# Altium schematic sheet lab1_shkabara_usb_rs232.SchDoc: =title_line_1 + title_line_2
size 594 x 420 mm; SheetNumber: n
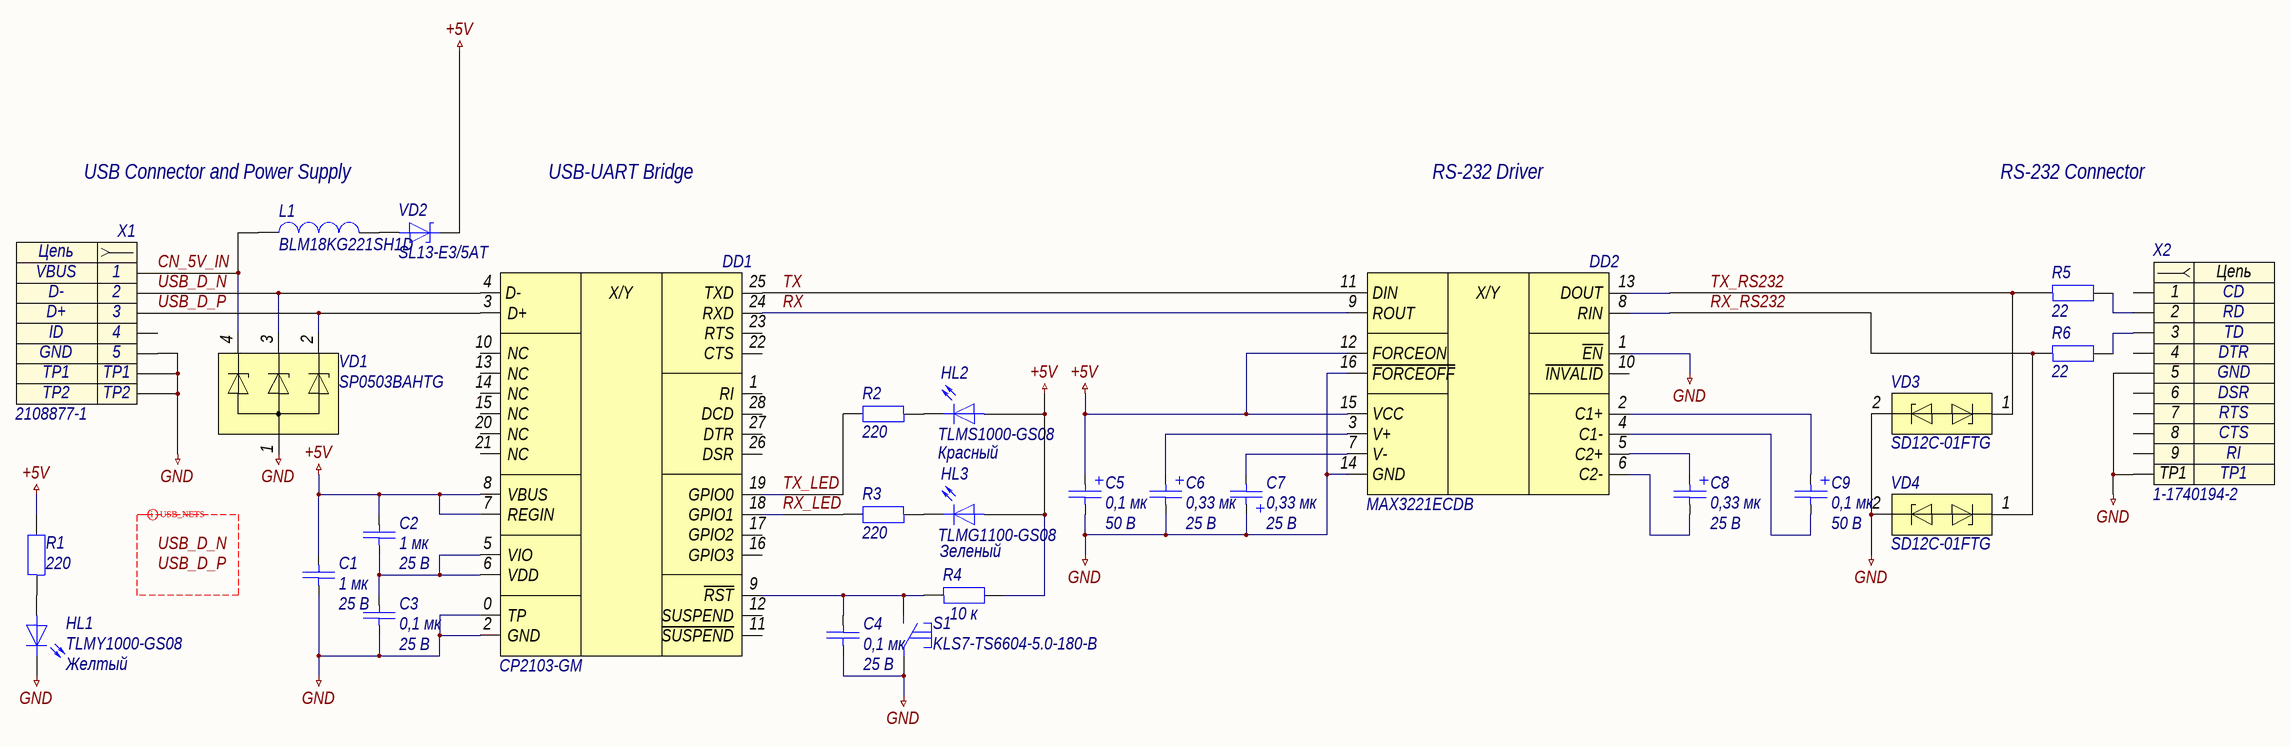
[diagram p0: lab1_shkabara_usb_rs232.SchDoc]

## Parts
C1  1 мк  Напряжение: 25 В  [C0603]
C2  1 мк  Напряжение: 25 В  [C0603]
C3  0,1 мк  Напряжение: 25 В  [C0603]
C4  0,1 мк  Напряжение: 25 В  [C0603]
C5  0,1 мк  Напряжение: 50 В  [C3216-18]
C6  0,33 мк  Напряжение: 25 В  [C3216-18]
C7  0,33 мк  Напряжение: 25 В  [C3216-18]
C8  0,33 мк  Напряжение: 25 В  [C3216-18]
C9  0,1 мк  Напряжение: 50 В  [C3216-18]
DD1  CP2103-GM  [QFN-28-500X500X90]
DD2  MAX3221ECDB  [SSOP-16-620X530X195]
HL1  TLMY1000-GS08  Цвет: Желтый  [HL0603]
HL2  TLMS1000-GS08  Цвет: Красный  [HL0603]
HL3  TLMG1100-GS08  Цвет: Зеленый  [HL0603]
L1  BLM18KG221SH1D  [BLM-2-0603]
R1  220  [R0603]
R2  220  [R0603]
R3  220  [R0603]
R4  10 к  [R0603]
R5  22  [R0603]
R6  22  [R0603]
S1  KLS7-TS6604-5.0-180-B  [KLS7-TS6604-5.0-180-B]
VD1  SP0503BAHTG  [SOT-143-4]
VD2  SL13-E3/5AT  [DO-214AC]
VD3  SD12C-01FTG  [SOD-323]
VD4  SD12C-01FTG  [SOD-323]
X1  2108877-1  [2108877-1]
X2  1-1740194-2  [1-1740194-2]

## Nets
+5V: C1.1 C2.1 C5.1 DD1.7(REGIN) DD1.8(VBUS) DD2.12(FORCEON) DD2.15(VCC) HL2.2 HL3.2 R1.2 R4.2 VD2.1
GND: C1.2 C3.2 C4.1 C5.2 C6.2 C7.1 DD1.0(TP) DD1.2(GND) DD2.1(~{EN}) DD2.14(GND) DD2.16(~{FORCEOFF}) HL1.1 S1.1 VD1.1 VD3.2 VD4.2 X1.5 X1.TP1 X1.TP2 X2.5 X2.TP1
CN_5V_IN: L1.1 VD1.4 X1.1
RX: DD1.24(RXD) DD2.9(ROUT)
RX_LED: DD1.18(GPIO1) R3.2
RX_RS232: DD2.8(RIN) R6.1 VD4.1
TX: DD1.25(TXD) DD2.11(DIN)
TX_LED: DD1.19(GPIO0) R2.2
TX_RS232: DD2.13(DOUT) R5.1 VD3.1
USB_D_N: DD1.4(D-) VD1.3 X1.2
USB_D_P: DD1.3(D+) VD1.2 X1.3
NetC2_2: C2.2 C3.1 DD1.5(VIO) DD1.6(VDD)
NetC4_2: C4.2 DD1.9(~{RST}) R4.1 S1.2
NetC6_1: C6.1 DD2.3(V+)
NetC7_2: C7.2 DD2.7(V-)
NetC8_1: C8.1 DD2.5(C2+)
NetC8_2: C8.2 DD2.6(C2-)
NetC9_1: C9.1 DD2.2(C1+)
NetC9_2: C9.2 DD2.4(C1-)
NetHL1_2: HL1.2 R1.1
NetHL2_1: HL2.1 R2.1
NetHL3_1: HL3.1 R3.1
NetL1_2: L1.2 VD2.2
NetR5_2: R5.2 X2.2
NetR6_2: R6.2 X2.3

Not connected (* = marked no-connect by the designer): DD1 1(RI) 10(NC) 11(~{SUSPEND}) 12(SUSPEND) 13(NC) 14(NC) 15(NC) 16(GPIO3) 17(GPIO2) 20(NC) 21(NC) 22(CTS) 23(RTS) 26(DSR) 27(DTR) 28(DCD); DD2 10(~{INVALID}); X1 4; X2 1 4 6 7 8 9

## Layout directives
differential pair; rule Differential Pairs Routing [Pref Gap = 0.254mm    Min Gap  = 0.15mm    Max Gap  = 0.254mmPref Width = 0.381mm    Min Width  = 0.155mm    Max Width  = 0.381mm]; differential pair class USB_SIGNALS: USB_D_N, USB_D_P

## Notes on the sheet
- USB Connector and Power Supply
- USB-UART Bridge
- RS-232 Driver
- RS-232 Connector
- Labels drawn without touching a wire or pin: USB_D_N, USB_D_P
- Перв. примен.
- Справ. №
- Подп. и дата
- Инв. № дубл.
- Нормоконтроль:
- Взам. инв. №
- Изм.
- Лист
- № докум.
- Подп.
- Дата
- Лит.
- Масса
- Масштаб
- Т.контр.
- Пров.
- Разраб.
- Листов
- Разработал:
- Инв. № подл.
- Н.контр.
- Утв.
- Копировал
- Формат
- А2
- (in symbol 2108877-1_micro_usb-b) Цепь
- (in symbol dd0004) X/Y
- (in symbol dd0019) X/Y
- (in symbol HEADER-9-TP1-SCT) Цепь

## Library data of the parts
C1 C2 = c0090: =Описание; ID: c0090; Фамилия: Ларионов; Описание: Конденсатор керамический чип 0603 1 мкФ 25 В ±10 %; Наименование: CC0603KRX7R8BB105; Производитель: YAGEO Corp.; Отклонение: ±10 %; Рабочие температуры: от –55 °С до +125 °С; Температурный коэффициент емкости: X7R; Корпус: 0603; Номинал: 1 мк; Номинальное напряжение: 25 В; HelpURL: https://www.yageo.com/upload/media/product/productsearch/datasheet/mlcc/UPY-GPHC_X7R_6.3V-to-50V_20.pdf
C3 C4 = c0058: =Описание; ID: c0058; Фамилия: Паньков; Описание: Конденсатор керамический чип 0603 100 нФ 25 В ±10 %; Наименование: CC0603KRX7R8BB104; Производитель: YAGEO Corp.; Отклонение: ±10 %; Рабочие температуры: от –55 °С до +125 °С; Температурный коэффициент емкости: X7R; Корпус: 0603; Номинал: 0,1 мк; Номинальное напряжение: 25 В; HelpURL: https://www.yageo.com/upload/media/product/productsearch/datasheet/mlcc/UPY-GPHC_X7R_6.3V-to-50V_20.pdf
C5 C9 = c0001: =Описание; ID: c0001; Фамилия: Ларионов; Описание: Конденсатор танталовый чип 3216-18 100 нФ 50 В ±10 %; Наименование: 293D104X9050A2TE3; Производитель: Vishay Intertechnology, Inc.; Отклонение: ±10 %; Эквивалентное последовательное сопротивление: 19,0 Ом; Среднеквадратичный размах пульсации тока: 0,06 А; Рабочие температуры: от –55 °С до +125 °С; Корпус: 3216-18; Номинал: 0,1 мк; Номинальное напряжение: 50 В; HelpURL: https://www.vishay.com/capacitors/list/product-40002/
C6-C8 = c0004: =Описание; ID: c0004; Фамилия: Паньков; Описание: Конденсатор танталовый чип 3216-18 330 нФ 25 В ±10 %; Наименование: 293D334X9025A2TE3; Производитель: Vishay Intertechnology, Inc.; Отклонение: ±10 %; Эквивалентное последовательное сопротивление: 13,0 Ом; Среднеквадратичный размах пульсации тока: 0,08 А; Рабочие температуры: от –55 °С до +125 °С; Корпус: 3216-18; Номинал: 0,33 мк; Номинальное напряжение: 25 В; HelpURL: https://www.vishay.com/capacitors/list/product-40002/
DD1 = dd0004: =Описание; ID: dd0004; Фамилия: Кондрашова; Описание: Преобразователь USB-UART; Производитель: Silicon Laboratories; Корпус: QFN-28; Наименование: CP2103-GM; HelpURL: https://www.silabs.com/interface/usb-bridges/classic/device.cp2103
DD2 = dd0019: =Описание; ID: dd0019; Фамилия: Шкабара; Описание: Приемопередатчик RS-232; Производитель: Texas Instruments; Корпус: SSOP-16; Наименование: MAX3221ECDB; HelpURL: https://www.ti.com/product/MAX3221E
HL1 = hl0003: =Описание; ID: hl0003; Фамилия: Ларионов; Описание: Светодиод чип 0603 желтый; Производитель: Vishay Intertechnology, Inc.; Номинальная сила света: 7,5 мкд; Номинальная длина волны: 588 нм; Номинальный прямой ток: 15 мА; Номинальное падение напряжения: 1,8 В; Рассеиваемая мощность: 40 мВт; Рабочие температуры: от –40 °С до +100 °С; Корпус: 0603; Наименование: TLMY1000-GS08; HelpURL: https://www.vishay.com/leds/list/product-83172/
HL2 = hl0001: =Описание; ID: hl0001; Фамилия: Ларионов; Описание: Светодиод чип 0603 красный; Производитель: Vishay Intertechnology, Inc.; Номинальная сила света: 4 мкд; Номинальная длина волны: 628 нм; Номинальный прямой ток: 15 мА; Номинальное падение напряжения: 1,8 В; Рассеиваемая мощность: 40 мВт; Рабочие температуры: от –40 °С до +100 °С; Корпус: 0603; Наименование: TLMS1000-GS08; HelpURL: https://www.vishay.com/leds/list/product-83172/
HL3 = hl0005: =Описание; ID: hl0005; Фамилия: Ларионов; Описание: Светодиод чип 0603 зеленый; Производитель: Vishay Intertechnology, Inc.; Номинальная сила света: 35 мкд; Номинальная длина волны: 570 нм; Номинальный прямой ток: 30 мА; Номинальное падение напряжения: 2,1 В; Рассеиваемая мощность: 90 мВт; Рабочие температуры: от –40 °С до +100 °С; Корпус: 0603; Наименование: TLMG1100-GS08; HelpURL: https://www.vishay.com/leds/list/product-83173/
L1 = l0001: =Описание; ID: l0001; Фамилия: Ларионов; Описание: Ферритовая бусина 220 Ом ±25 %; Производитель: Murata Manufacturing Co., Ltd.; Сопротивление, 100 МГц: 220 Ом; Отклонение, 100 МГц: ±25 %; Сопротивление при постоянном токе: 0,05 Ом; Рабочие температуры: от –55 °С до +125 °С; Корпус: 0603; Наименование: BLM18KG221SH1D; HelpURL: https://www.murata.com/en-global/products/productdetail?partno=BLM18KG221SH1%23
R1-R3 = r0015: =Описание; ID: r0015; Фамилия: Ларионов; Описание: Резистор чип 0603 220 Ом ±1 % 0,1 Вт; Наименование: RC0603FR-07220RL; Производитель: YAGEO Corp.; Отклонение: ±1 %; Номинальное напряжение: 75 В; Номинальный ток: 1 А; Рабочие температуры: от –55 °С до +155 °С; Корпус: 0603; Примечание: Ряд E24; Номинал: 220; HelpURL: https://www.yageo.com/upload/media/product/productsearch/datasheet/rchip/PYu-RC_Group_51_RoHS_L_11.pdf
R4 = r0060: =Описание; ID: r0060; Фамилия: Самарин; Описание: Резистор чип 0603 10 кОм ±1 % 0,1 Вт; Наименование: RC0603FR-0710KL; Производитель: YAGEO Corp.; Отклонение: ±1 %; Номинальное напряжение: 75 В; Номинальный ток: 1 А; Рабочие температуры: от –55 °С до +155 °С; Корпус: 0603; Примечание: Ряд E24; Номинал: 10 к; HelpURL: https://www.yageo.com/upload/media/product/productsearch/datasheet/rchip/PYu-RC_Group_51_RoHS_L_11.pdf
R5 R6 = r0004: =Описание; ID: r0004; Фамилия: Ларионов; Описание: Резистор чип 0603 22 Ом ±1 % 0,1 Вт; Наименование: RC0603FR-0722RL; Производитель: YAGEO Corp.; Отклонение: ±1 %; Номинальное напряжение: 75 В; Номинальный ток: 1 А; Рабочие температуры: от –55 °С до +155 °С; Корпус: 0603; Примечание: Ряд E24; Номинал: 22; HelpURL: https://www.yageo.com/upload/media/product/productsearch/datasheet/rchip/PYu-RC_Group_51_RoHS_L_11.pdf
S1 = s0002: =Описание; ID: s0002; Фамилия: Паньков; Описание: Тактовая кнопка поверхностного монтажа; Производитель: Ningbo KLS Electronic Co., Ltd.; Ток нагрузки: 50 мА @ 12 В; Сопротивление контакта: 50 мОм; Количество контактов: 4; Рабочие температуры: от –20 °С до +70 °С; Промывка: Запрещена; Корпус: 6,00 x 6,00 x 5,00; Наименование: KLS7-TS6604-5.0-180-B; HelpURL: http://www.klsele.com/products/Switches/Tact-Switches-Series/939.html
VD1 = vd0001: =Описание; ID: vd0001; Фамилия: Ларионов; Описание: Диодная сборка для подавления помех, 5 В; Производитель: Littelfuse, Inc.; Наименование: SP0503BAHTG; Корпус: SOT-143-4; HelpURL: https://www.littelfuse.com/products/tvs-diode-arrays/general-purpose-esd-protection/sp050xba-lead-free-green.aspx
VD2 = vd0003: =Описание; ID: vd0003; Фамилия: Ларионов; Описание: Диод Шоттки 30 В 1,5 А; Производитель: Vishay Intertechnology, Inc.; Максимальное прямое напряжение: 0,445 В; Максимальное обратное напряжение: 30 В; Максимальный прямой ток: 1,5 А; Рабочие температуры: от –55 °С до +125 °С; Наименование: SL13-E3/5AT; Корпус: DO-214AC; HelpURL: https://www.vishay.com/product?docid=88740
VD3 VD4 = vd0003: =Описание; ID: vd0003; Фамилия: Ларионов; Описание: Двунаправленная диодная сборка для подавления помех, 12 В; Производитель: Littelfuse, Inc.; Наименование: SD12C-01FTG; Корпус: SOD-323; HelpURL: https://www.littelfuse.com/products/tvs-diode-arrays/general-purpose-esd-protection/sdc/sd12c_01ftg.aspx
X1 = 2108877-1_micro_usb-b: Contact_1: VBUS; Contact_2: D-; Contact_3: D+; Contact_4: ID; Contact_5: GND; Наименование: 2108877-1
X2 = HEADER-9-TP1-SCT: D-Sub 9 pin Board-to-Board; Contact_1: CD; Contact_2: RD; Contact_3: TD; Contact_4: DTR; Contact_5: GND; Contact_6: DSR; Contact_7: RTS; Contact_8: CTS; Contact_9: RI; ID: x0002; Фамилия: Ларионов; Производитель: TE Connectivity; Описание: D-Sub 9 pin Board-to-Board; Наименование: 1-1740194-2; HelpURL: https://www.te.com/global-en/product-1-1740194-2.html